# EAGLE design Sprite_Sail (EAGLE 9.0.0)
Assembly variants: hdmid
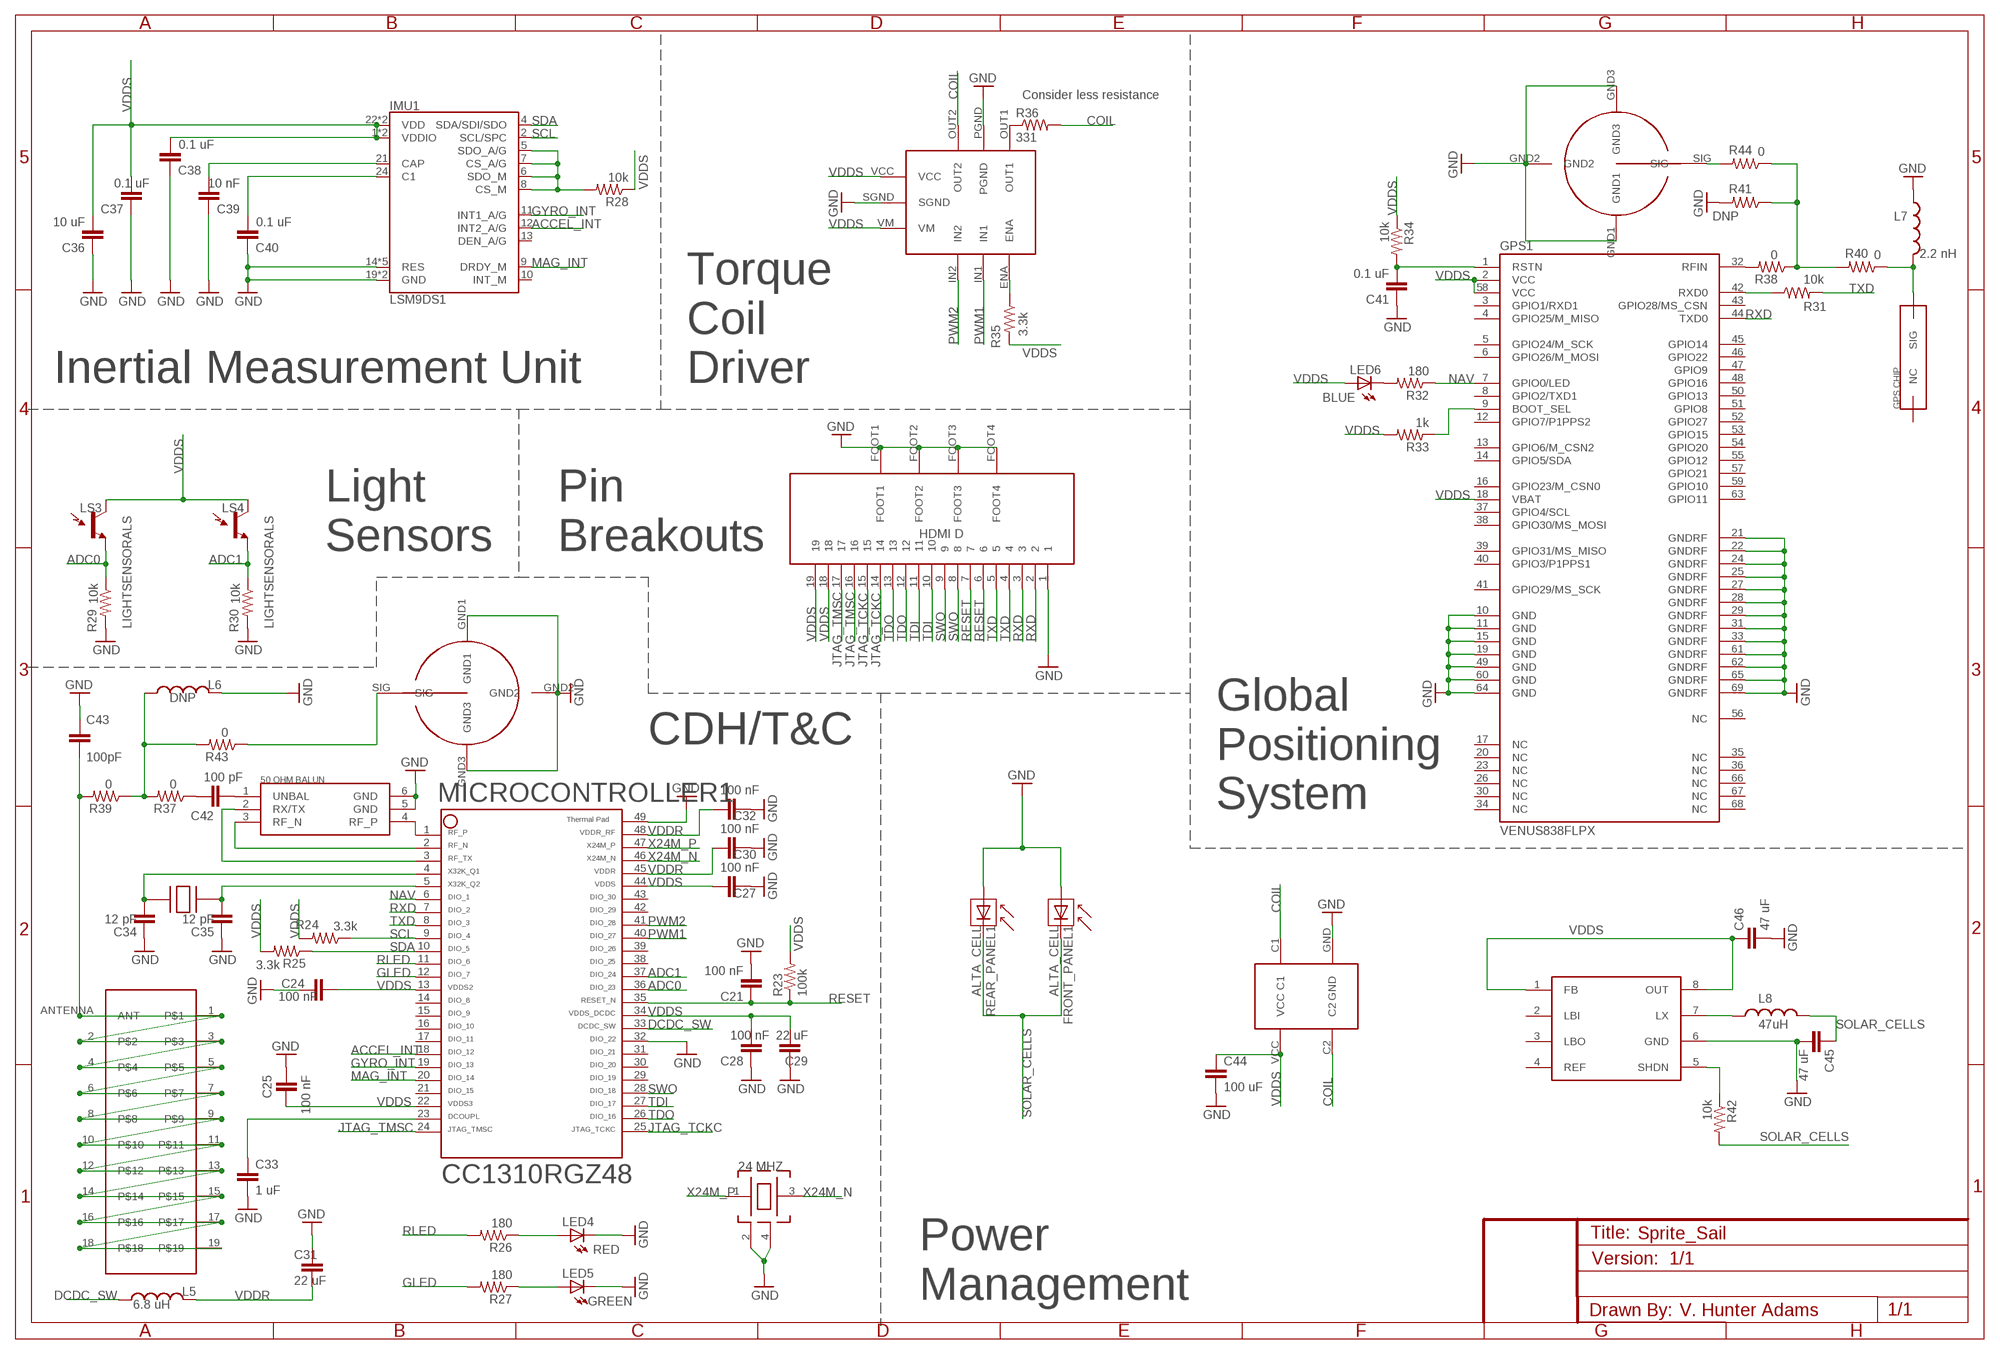
[diagram p0: schematic, sheet 1]

## Parts
32.1  FC-135  [FC-135]
BALUN1  JOHANSON_BALUN  [JOHANSON_BALUN]
C21  100 nF  CAP0402-CAP  [0402-CAP]
C24  100 nF  CAP0402-CAP  [0402-CAP]
C25  100 nF  CAP0402-CAP  [0402-CAP]
C27  100 nF  CAP0402-CAP  [0402-CAP]
C28  100 nF  CAP0402-CAP  [0402-CAP]
C29  22 uF  CAP0402-CAP  [0402-CAP]
C30  100 nF  CAP0402-CAP  [0402-CAP]
C31  22 uF  CAP0402-CAP  [0402-CAP]
C32  100 nF  CAP0402-CAP  [0402-CAP]
C33  1 uF  CAP0402-CAP  [0402-CAP]
C34  12 pF  CAP0402-CAP  [0402-CAP]
C35  12 pF  CAP0402-CAP  [0402-CAP]
C36  10 uF  CAP0402-CAP  [0402-CAP]
C37  0.1 uF  CAP0402-CAP  [0402-CAP]
C38  0.1 uF  CAP0402-CAP  [0402-CAP]
C39  10 nF  CAP0402-CAP  [0402-CAP]
C40  0.1 uF  CAP0402-CAP  [0402-CAP]
C41  0.1 uF  CAP0402-CAP  [0402-CAP]
C42  100 pF  CAP0402-CAP  [0402-CAP]
C43  100pF  CAP0603-CAP  [0603-CAP]
C44  100 uF  CAP0805  [0805]
C45  47 uF  CAP0805  [0805]
C46  47 uF  CAP0805  [0805]
FRONT_PANEL1  ALTA_CELL  [ALTA_CELL]
GPS1  VENUS838FLPX  [VENUS838FLPX]
IMU1  LSM9DS1  [LGA24-8X4]
L5  6.8 uH  INDUCTOR0603  [0603]
L6  DNP  INDUCTOR0603  [0603]
L7  2.2 nH  INDUCTOR0603  [0603]
L8  47uH  INDUCTOR0603  [0603]
LED4  RED  LED0603  [LED-0603]
LED5  GREEN  LED0603  [LED-0603]
LED6  BLUE  LED0603  [LED-0603]
LS3  LIGHTSENSORALS  [ALS-PT19]
LS4  LIGHTSENSORALS  [ALS-PT19]
MICROCONTROLLER1  CC1310  [CC1310]
R23  100k  RESISTOR0402-RES  [0402-RES]
R24  3.3k  RESISTOR0402-RES  [0402-RES]
R25  3.3k  RESISTOR0402-RES  [0402-RES]
R26  180  RESISTOR0402-RES  [0402-RES]
R27  180  RESISTOR0402-RES  [0402-RES]
R28  10k  RESISTOR0402-RES  [0402-RES]
R29  10k  RESISTOR0402-RES  [0402-RES]
R30  10k  RESISTOR0402-RES  [0402-RES]
R31  10k  RESISTOR0402-RES  [0402-RES]
R32  180  RESISTOR0402-RES  [0402-RES]
R33  1k  RESISTOR0402-RES  [0402-RES]
R34  10k  RESISTOR0402-RES  [0402-RES]
R35  3.3k  RESISTOR0402-RES  [0402-RES]
R36  331  RESISTOR0402-RES  [0402-RES]
R37  0  RESISTOR0603-RES  [0603-RES]
R38  0  RESISTOR0603-RES  [0603-RES]
R39  0  RESISTOR0603-RES  [0603-RES]
R40  0  RESISTOR0603-RES  [0603-RES]
R41  DNP  RESISTOR0603-RES  [0603-RES]
R42  10k  RESISTOR0402-RES  [0402-RES]
R43  0  RESISTOR0603-RES  [0603-RES]
R44  0  RESISTOR0603-RES  [0603-RES]
REAR_PANEL1  ALTA_CELL  [ALTA_CELL]
TSX1  TSX-3225  [TSX-3225]
U$1  LV8417CS  [LV8417CS]
U$10  JOHANSON_GPS_CHIP  [JOHANSON_GPS_CHIP]
U$11  PANASONIC_RECTIFIER  [PANASONIC_RECTIFIER]
U$12  PCB_ANTENNA  [PCB_ANTENNA]
U$13  MM5329-2700  [MM5829-2700]
U$14  MM5329-2700  [MM5829-2700]
U$15  L6920  [L6920]
U$16  HDMID  [HDMID]

## Nets
ACCEL_INT: IMU1.12(INT2_A/G) MICROCONTROLLER1.18
ADC0: LS3.E(E1) MICROCONTROLLER1.36 R29.1
ADC1: LS4.E(E1) MICROCONTROLLER1.37 R30.1
ANTENNA1: C43.2 R39.2 U$12.1 U$12.2 U$12.3 U$12.4 U$12.5 U$12.6 U$12.7 U$12.8 U$12.9 U$12.10 U$12.11 U$12.12 U$12.13 U$12.14 U$12.15 U$12.16 U$12.17 U$12.18 U$12.19 U$12.ANTENNA(ANT)
COIL: R36.2 U$1.OUT2 U$11.C1 U$11.C2
DCDC_SW: L5.1 MICROCONTROLLER1.33
GLED: MICROCONTROLLER1.12 R27.2
GND: BALUN1.5(GND) BALUN1.6(GND) C21.2 C24.2 C25.2 C27.2 C28.2 C29.2 C30.2 C31.2 C32.2 C33.2 C34.2 C35.2 C36.2 C37.2 C38.2 C39.2 C40.2 C41.2 C43.1 C44.2 C45.2 C46.2 FRONT_PANEL1.- GPS1.10(GND) GPS1.11(GND) GPS1.15(GND) GPS1.19(GND) GPS1.21(GNDRF) GPS1.22(GNDRF) GPS1.24(GNDRF) GPS1.25(GNDRF) GPS1.27(GNDRF) GPS1.28(GNDRF) GPS1.29(GNDRF) GPS1.31(GNDRF) GPS1.33(GNDRF) GPS1.49(GND) GPS1.60(GND) GPS1.61(GNDRF) GPS1.62(GNDRF) GPS1.64(GND) GPS1.65(GNDRF) GPS1.69(GNDRF) IMU1.14(RES) IMU1.15(RES) IMU1.16(RES) IMU1.17(RES) IMU1.18(RES) IMU1.19(GND) IMU1.20(GND) L6.2 L7.1 LED4.C LED5.C MICROCONTROLLER1.32 MICROCONTROLLER1.49 R29.2 R30.2 R41.2 REAR_PANEL1.- TSX1.2 TSX1.4 U$1.PGND U$1.SGND U$11.GND U$13.GND1 U$13.GND2 U$13.GND3 U$14.GND1 U$14.GND2 U$14.GND3 U$15.6(GND) U$16.1 U$16.FOOT1 U$16.FOOT2 U$16.FOOT3 U$16.FOOT4
GYRO_INT: IMU1.11(INT1_A/G) MICROCONTROLLER1.19
JTAG_TCKC: MICROCONTROLLER1.25 U$16.14 U$16.15
JTAG_TMSC: MICROCONTROLLER1.24 U$16.16 U$16.17
MAG_INT: IMU1.9(DRDY_M) MICROCONTROLLER1.20
N$49: C33.1 MICROCONTROLLER1.23
N$50: 32.1.P2 C34.1 MICROCONTROLLER1.4
N$51: 32.1.P1 C35.1 MICROCONTROLLER1.5
N$52: LED4.A R26.1
N$53: LED5.A R27.1
N$54: C39.1 IMU1.21(CAP)
N$55: C40.1 IMU1.24(C1)
N$56: IMU1.5(SDO_A/G) IMU1.6(SDO_M) IMU1.7(CS_A/G) IMU1.8(CS_M) R28.2
N$57: GPS1.42(RXD0) R31.1
N$58: LED6.C R32.2
N$59: GPS1.9(BOOT_SEL) R33.1
N$60: C41.1 GPS1.1(RSTN) R34.2
N$61: R35.1 U$1.ENA
N$62: R36.1 U$1.OUT1
N$63: BALUN1.4(RF_P) MICROCONTROLLER1.1
N$64: BALUN1.3(RF_N) MICROCONTROLLER1.2
N$65: BALUN1.2(RX/TX) MICROCONTROLLER1.3
N$66: BALUN1.1(UNBAL) C42.2
N$67: L6.1 R37.2 R39.1 R43.2
N$68: C42.1 R37.1
N$69: GPS1.32(RFIN) R38.2
N$70: R38.1 R40.2 R41.1 R44.1
N$71: L7.2 R40.1 U$10.SIG
N$72: R42.1 U$15.5(SHDN)
N$73: L8.1 U$15.7(LX)
N$74: R44.2 U$14.SIG
N$75: R43.1 U$13.SIG
NAV: GPS1.7(GPIO0/LED) MICROCONTROLLER1.6 R32.1
PWM1: MICROCONTROLLER1.40 U$1.IN1
PWM2: MICROCONTROLLER1.41 U$1.IN2
RESET: C21.1 MICROCONTROLLER1.35 R23.1 U$16.6 U$16.7
RLED: MICROCONTROLLER1.11 R26.2
RXD: GPS1.44(TXD0) MICROCONTROLLER1.7 U$16.2 U$16.3
SCL: IMU1.2(SCL/SPC) MICROCONTROLLER1.9 R24.1
SDA: IMU1.4(SDA/SDI/SDO) MICROCONTROLLER1.10 R25.1
SOLAR_CELLS: C45.1 FRONT_PANEL1.+ L8.2 R42.2 REAR_PANEL1.+
SWO: MICROCONTROLLER1.28 U$16.8 U$16.9
TDI: MICROCONTROLLER1.27 U$16.10 U$16.11
TDO: MICROCONTROLLER1.26 U$16.12 U$16.13
TXD: MICROCONTROLLER1.8 R31.2 U$16.4 U$16.5
VDDR: C30.1 C31.1 C32.1 L5.2 MICROCONTROLLER1.45 MICROCONTROLLER1.48
VDDS: C24.1 C25.1 C27.1 C28.1 C29.1 C36.1 C37.1 C38.1 C44.1 C46.1 GPS1.2(VCC) GPS1.18(VBAT) GPS1.58(VCC) IMU1.1(VDDIO) IMU1.3(VDDIO) IMU1.22(VDD) IMU1.23(VDD) LED6.A LS3.C(C1) LS4.C(C1) MICROCONTROLLER1.13 MICROCONTROLLER1.22 MICROCONTROLLER1.34 MICROCONTROLLER1.44 R23.2 R24.2 R25.2 R28.1 R33.2 R34.1 R35.2 U$1.VCC U$1.VM U$11.VCC U$15.1(FB) U$15.8(OUT) U$16.18 U$16.19
X24M_N: MICROCONTROLLER1.46 TSX1.3
X24M_P: MICROCONTROLLER1.47 TSX1.1
Unconnected: GPS1.3(GPIO1/RXD1) GPS1.4(GPIO25/M_MISO) GPS1.5(GPIO24/M_SCK) GPS1.6(GPIO26/M_MOSI) GPS1.8(GPIO2/TXD1) GPS1.12(GPIO7/P1PPS2) GPS1.13(GPIO6/M_CSN2) GPS1.14(GPIO5/SDA) GPS1.16(GPIO23/M_CSN0) GPS1.17(NC) GPS1.20(NC) GPS1.23(NC) GPS1.26(NC) GPS1.30(NC) GPS1.34(NC) GPS1.35(NC) GPS1.36(NC) GPS1.37(GPIO4/SCL) GPS1.38(GPIO30/MS_MOSI) GPS1.39(GPIO31/MS_MISO) GPS1.40(GPIO3/P1PPS1) GPS1.41(GPIO29/MS_SCK) GPS1.43(GPIO28/MS_CSN) GPS1.45(GPIO14) GPS1.46(GPIO22) GPS1.47(GPIO9) GPS1.48(GPIO16) GPS1.50(GPIO13) GPS1.51(GPIO8) GPS1.52(GPIO27) GPS1.53(GPIO15) GPS1.54(GPIO20) GPS1.55(GPIO12) GPS1.56(NC) GPS1.57(GPIO21) GPS1.59(GPIO10) GPS1.63(GPIO11) GPS1.66(NC) GPS1.67(NC) GPS1.68(NC) IMU1.10(INT_M) IMU1.13(DEN_A/G) MICROCONTROLLER1.14 MICROCONTROLLER1.15 MICROCONTROLLER1.16 MICROCONTROLLER1.17 MICROCONTROLLER1.21 MICROCONTROLLER1.29 MICROCONTROLLER1.30 MICROCONTROLLER1.31 MICROCONTROLLER1.38 MICROCONTROLLER1.39 MICROCONTROLLER1.42 MICROCONTROLLER1.43 U$10.NC U$15.2(LBI) U$15.3(LBO) U$15.4(REF)

## Notes on the sheet
- Consider less resistance
- Inertial Measurement Unit
- Torque
  Coil
  Driver
- Light
  Sensors
- Pin
  Breakouts
- CDH/T&C
- Global
  Positioning
  System
- Power
  Management

## Library data of the parts
32.1 = FC-135:FC-135: FC-135 32.768KA-AG0
BALUN1 = JOHANSON_BALUN:JOHANSON_BALUN
C21 C24 C25 C27-C46 = SparkFun:CAP: Capacitor Standard 0603 ceramic capacitor, and 0.1" leaded capacitor.
FRONT_PANEL1 REAR_PANEL1 = ALTA_CELL:ALTA_CELL
GPS1 = VENUS838FLPX:VENUS838FLPX: Venus838FLPx-L
IMU1 = SparkFun-Sensors:LSM9DS1: LSM9DS1 3D accelerometer, gyroscope & magnetometer The LSM9DS1 is a system-in-package featuring a 3D digital linear acceleration sensor, a 3D digital angular rate sensor, and a 3D digital magnetic sensor. The LSM9DS1 has a linear acceleration full scale of ±2g/±4g/±8/±16 g, a magnetic field full scale of ±4/±8/±12/±16 gauss and an angular rate of ±245/±500/±2000 dps. The LSM9DS1 includes an I2 C serial bus interface supporting standard and fast mode (100 kHz and 400 kHz) and an SPI serial standard interface. Magnetic, accelerometer and gyroscope sensing can be enabled or set in power-down mode separately for smart power management. The LSM9DS1 is available in a plastic land grid array package (LGA) and it is guaranteed to operate over an extended temperature range from -40 °C to +85 °C.; PROD_ID: IC-12536
L5-L8 = SparkFun:INDUCTOR: Inductors Basic Inductor/Choke - 0603 and 1206. Footprints are not proven and vary greatly between part numbers.
LED4-LED6 = SparkFun:LED: LEDs Standard schematic elements and footprints for 5mm, 3mm, 1206, and 0603 sized LEDs. 5mm - Spark Fun Electronics SKU : COM-00529 (and others)
LS3 LS4 = SparkFun-Sensors:LIGHTSENSOR: Ambient Light Sensor Simple light detection sensor. Output varies with light intensity input. Spark Fun Electronics SKU : COM-08348; PROD_ID: IC-11836
MICROCONTROLLER1 = CC1310RGZ48:CC1310: CC1310 RGZ48 package
R23-R44 = SparkFun:RESISTOR: Resistor Basic schematic elements and footprints for 0603, 1206, and PTH resistors.
TSX1 = TSX-3225:TSX-3225
U$1 = LV8417CS:LV8417CS
U$10 = johanson_gps_chip:JOHANSON_GPS_CHIP
U$11 = Panasonic_Rectifier:PANASONIC_RECTIFIER
U$12 = PCB_ANTENNA:PCB_ANTENNA
U$13 U$14 = MM5329-2700:MM5329-2700
U$15 = L6920:L6920
U$16 = HDMID:HDMID

## Board
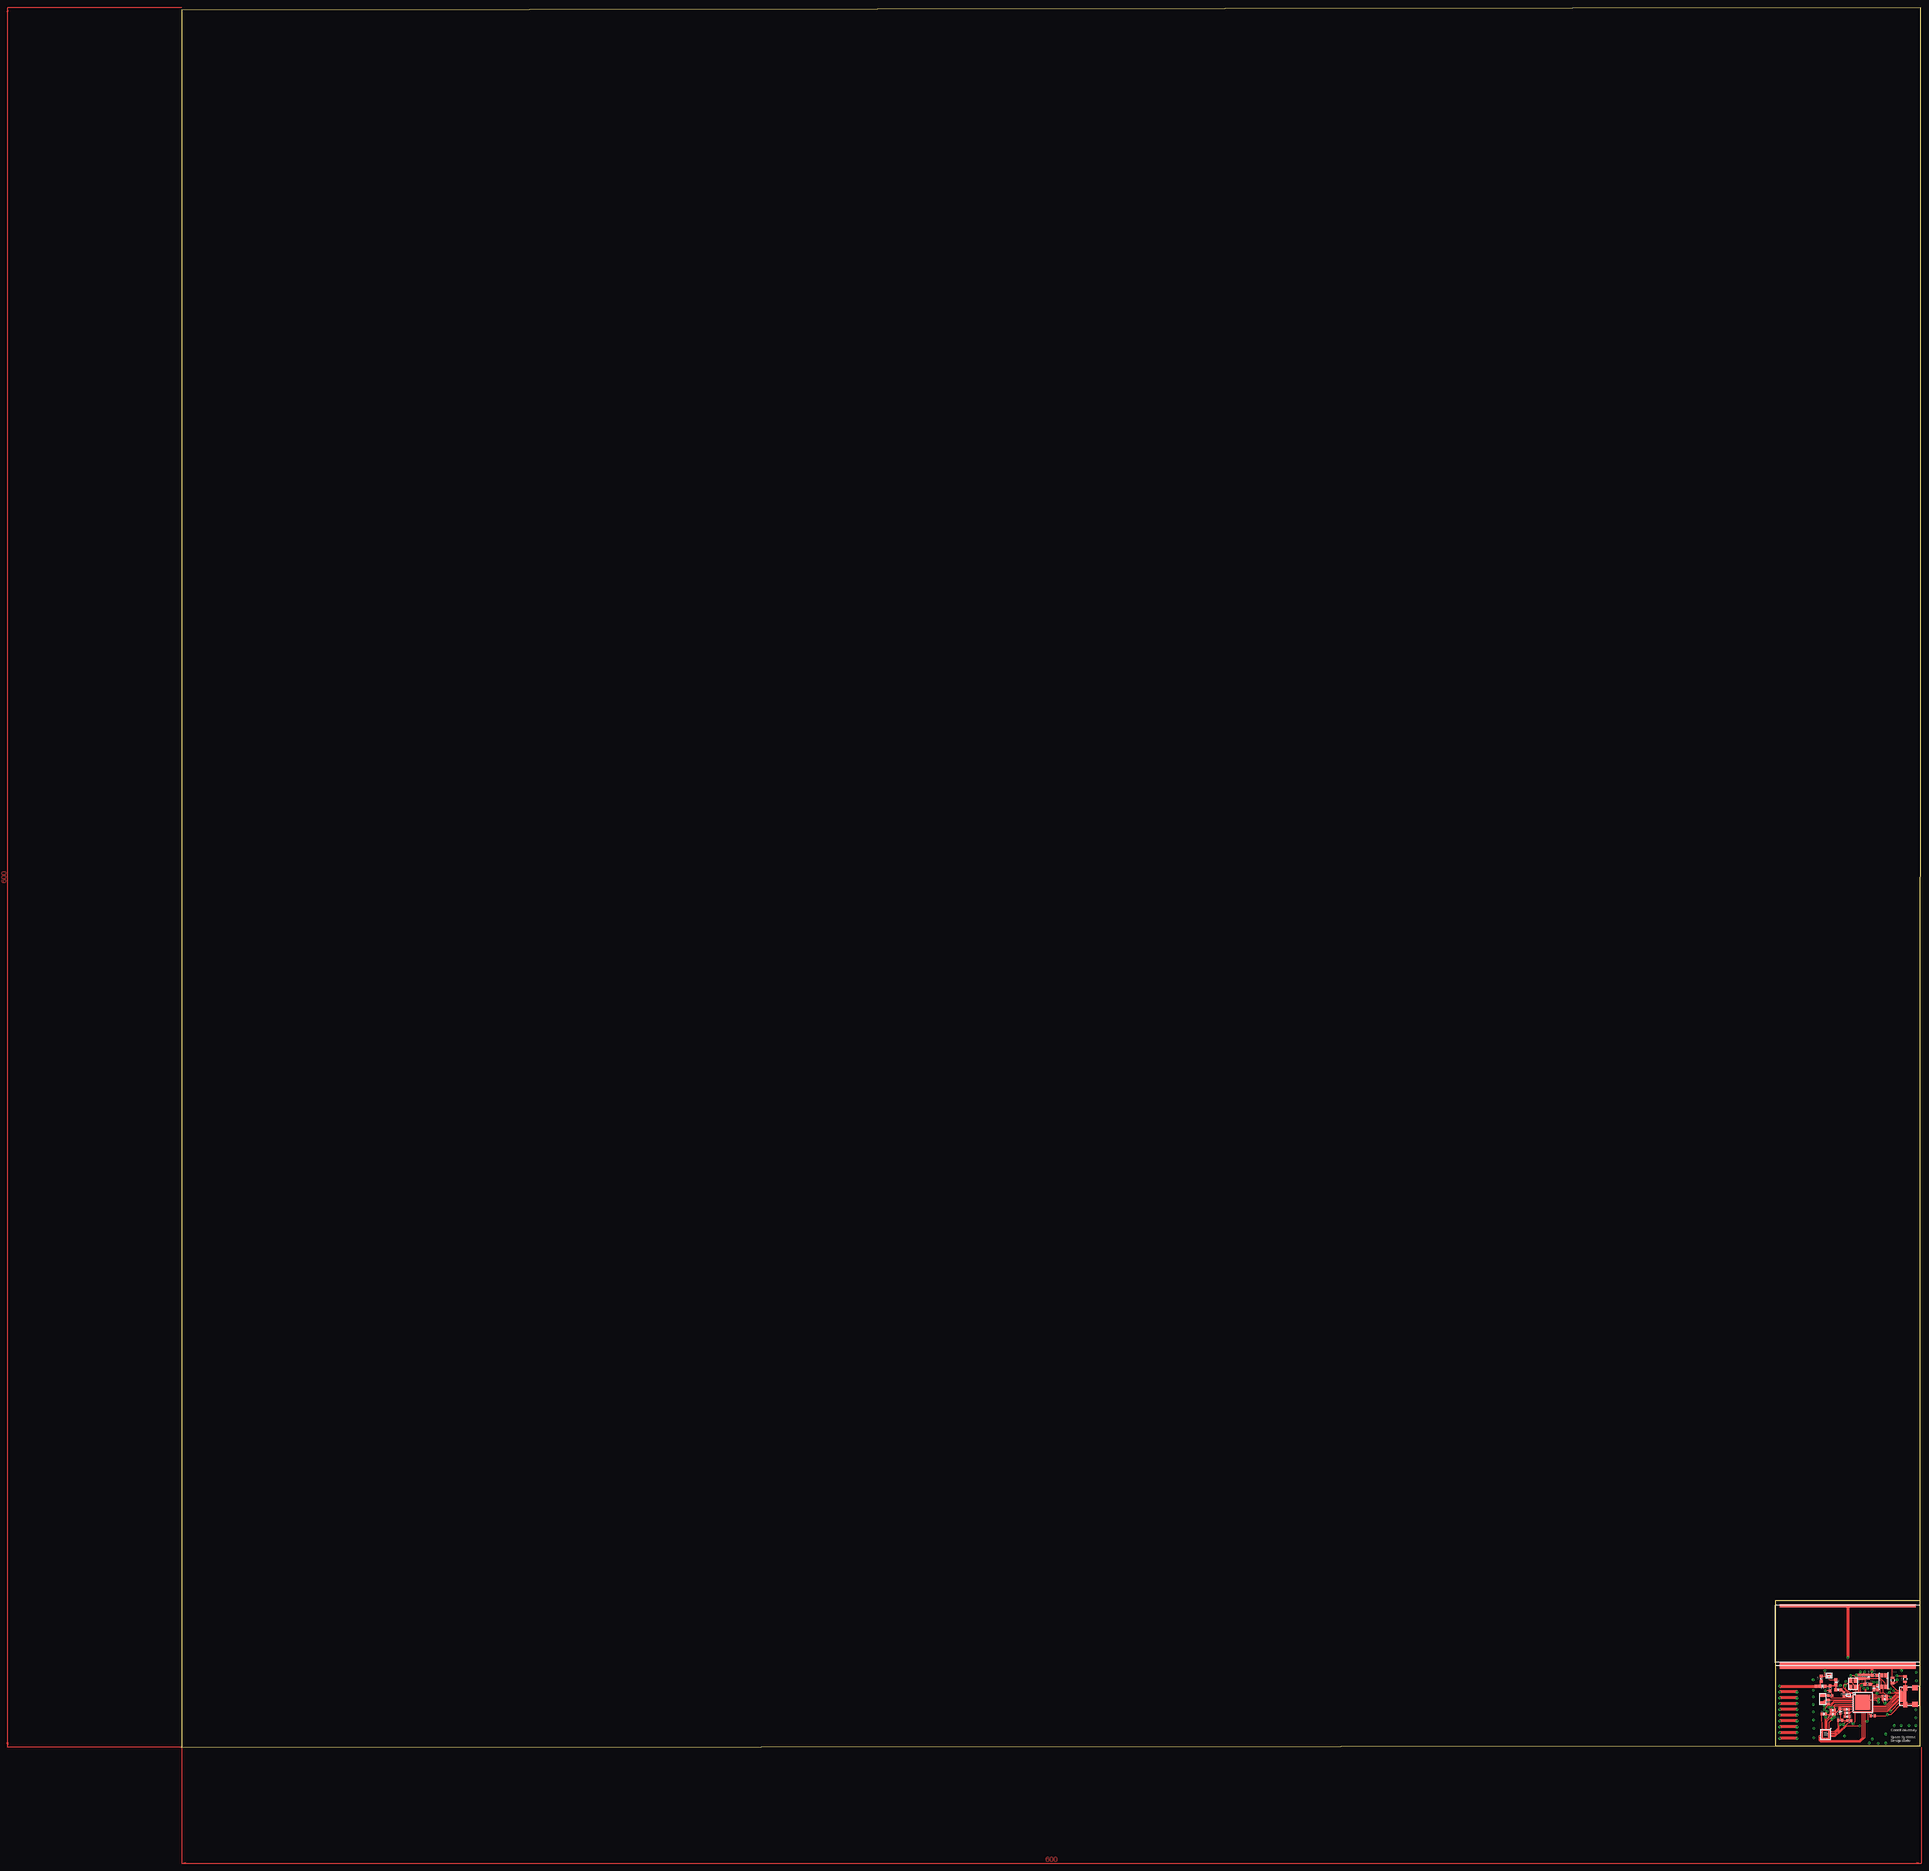
[diagram p1: board, top side]
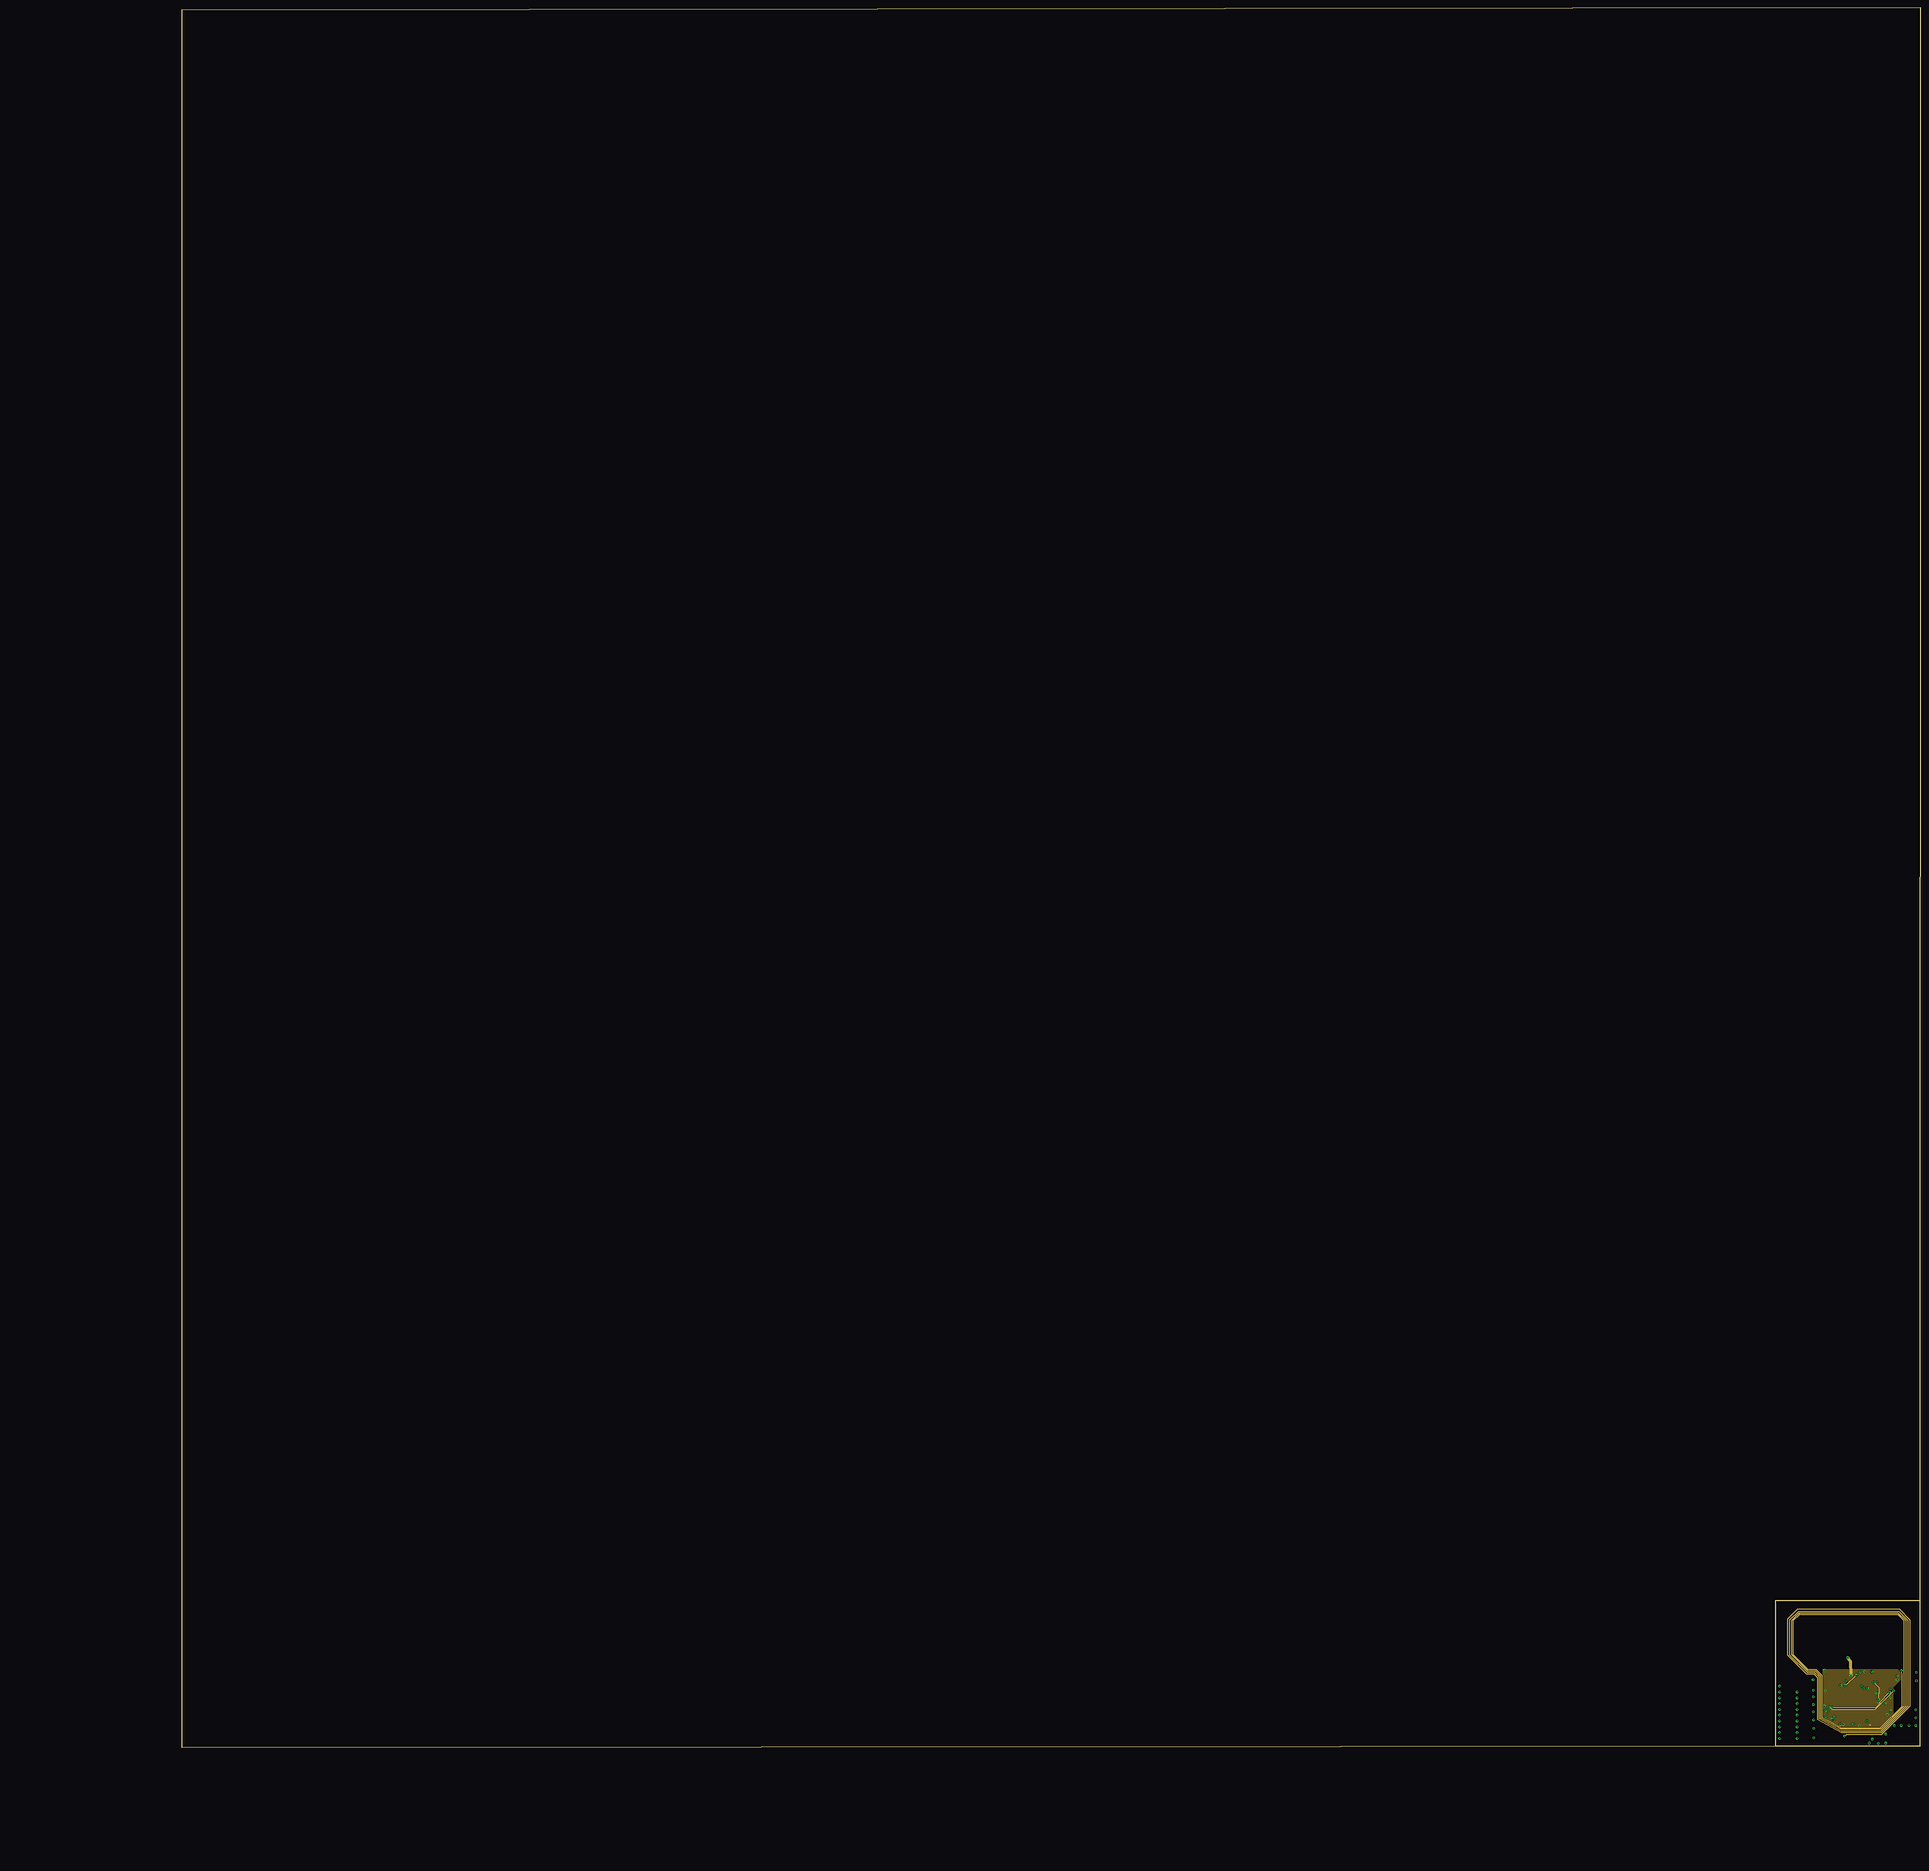
[diagram p2: board, inner layer Route2]
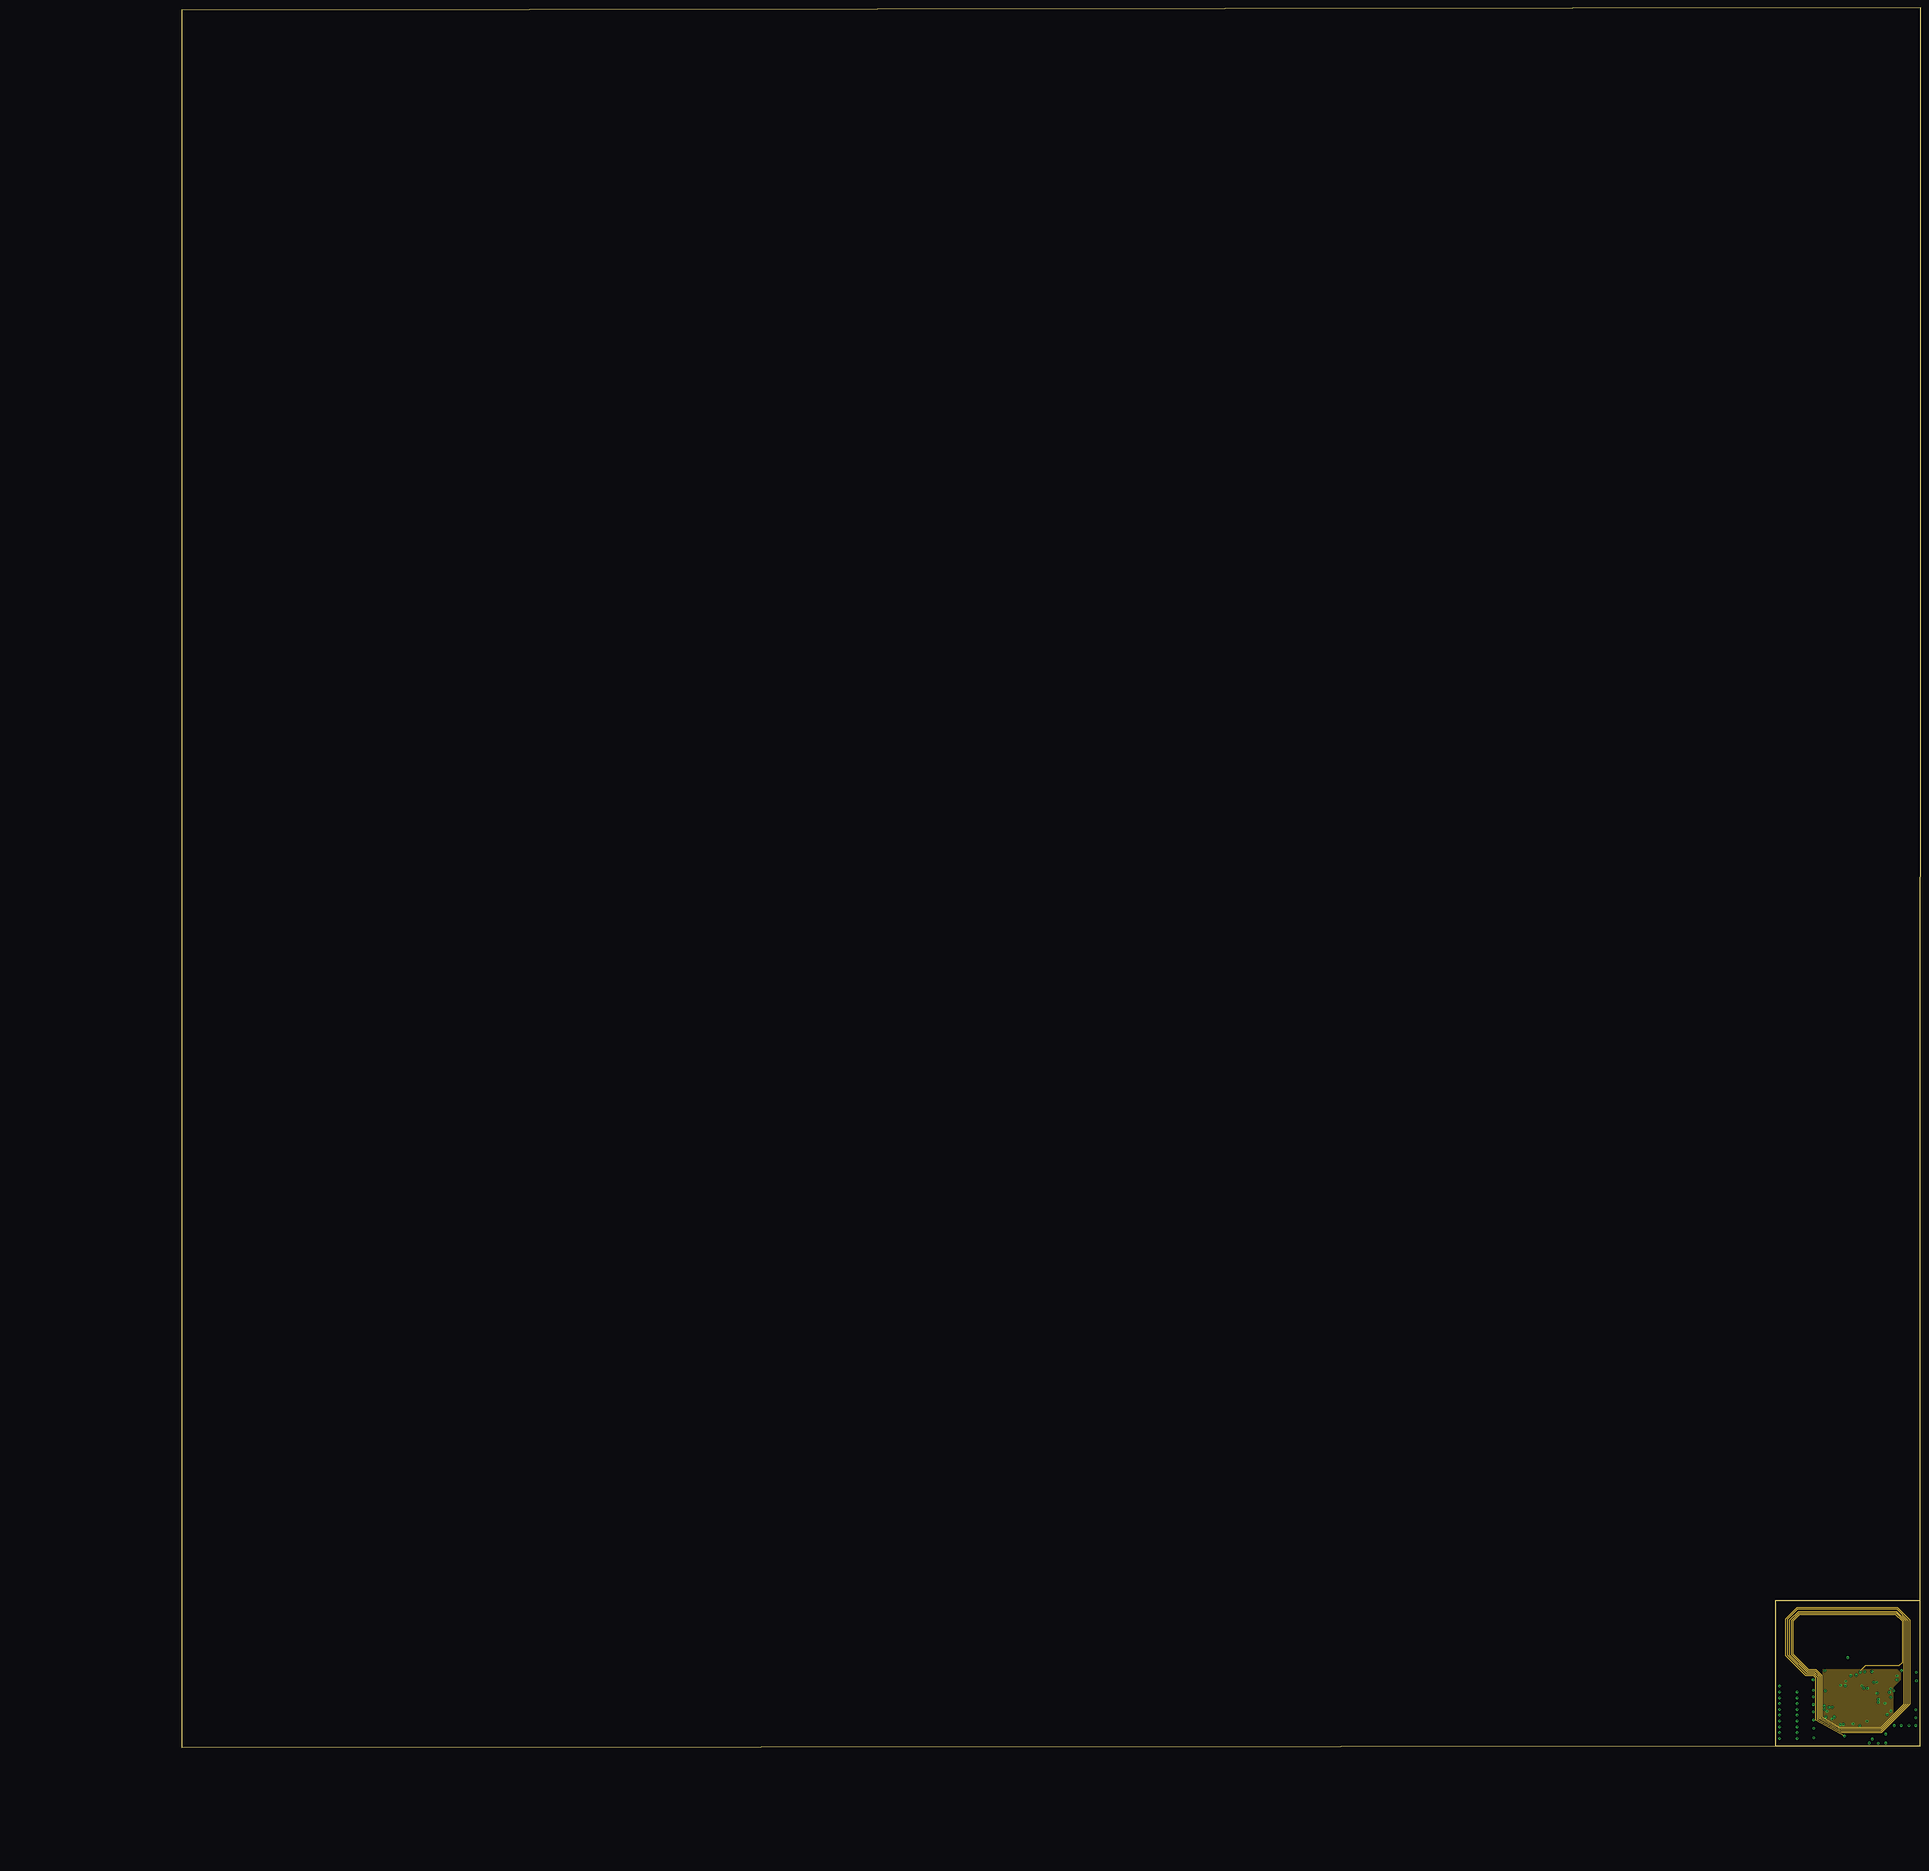
[diagram p3: board, inner layer Route15]
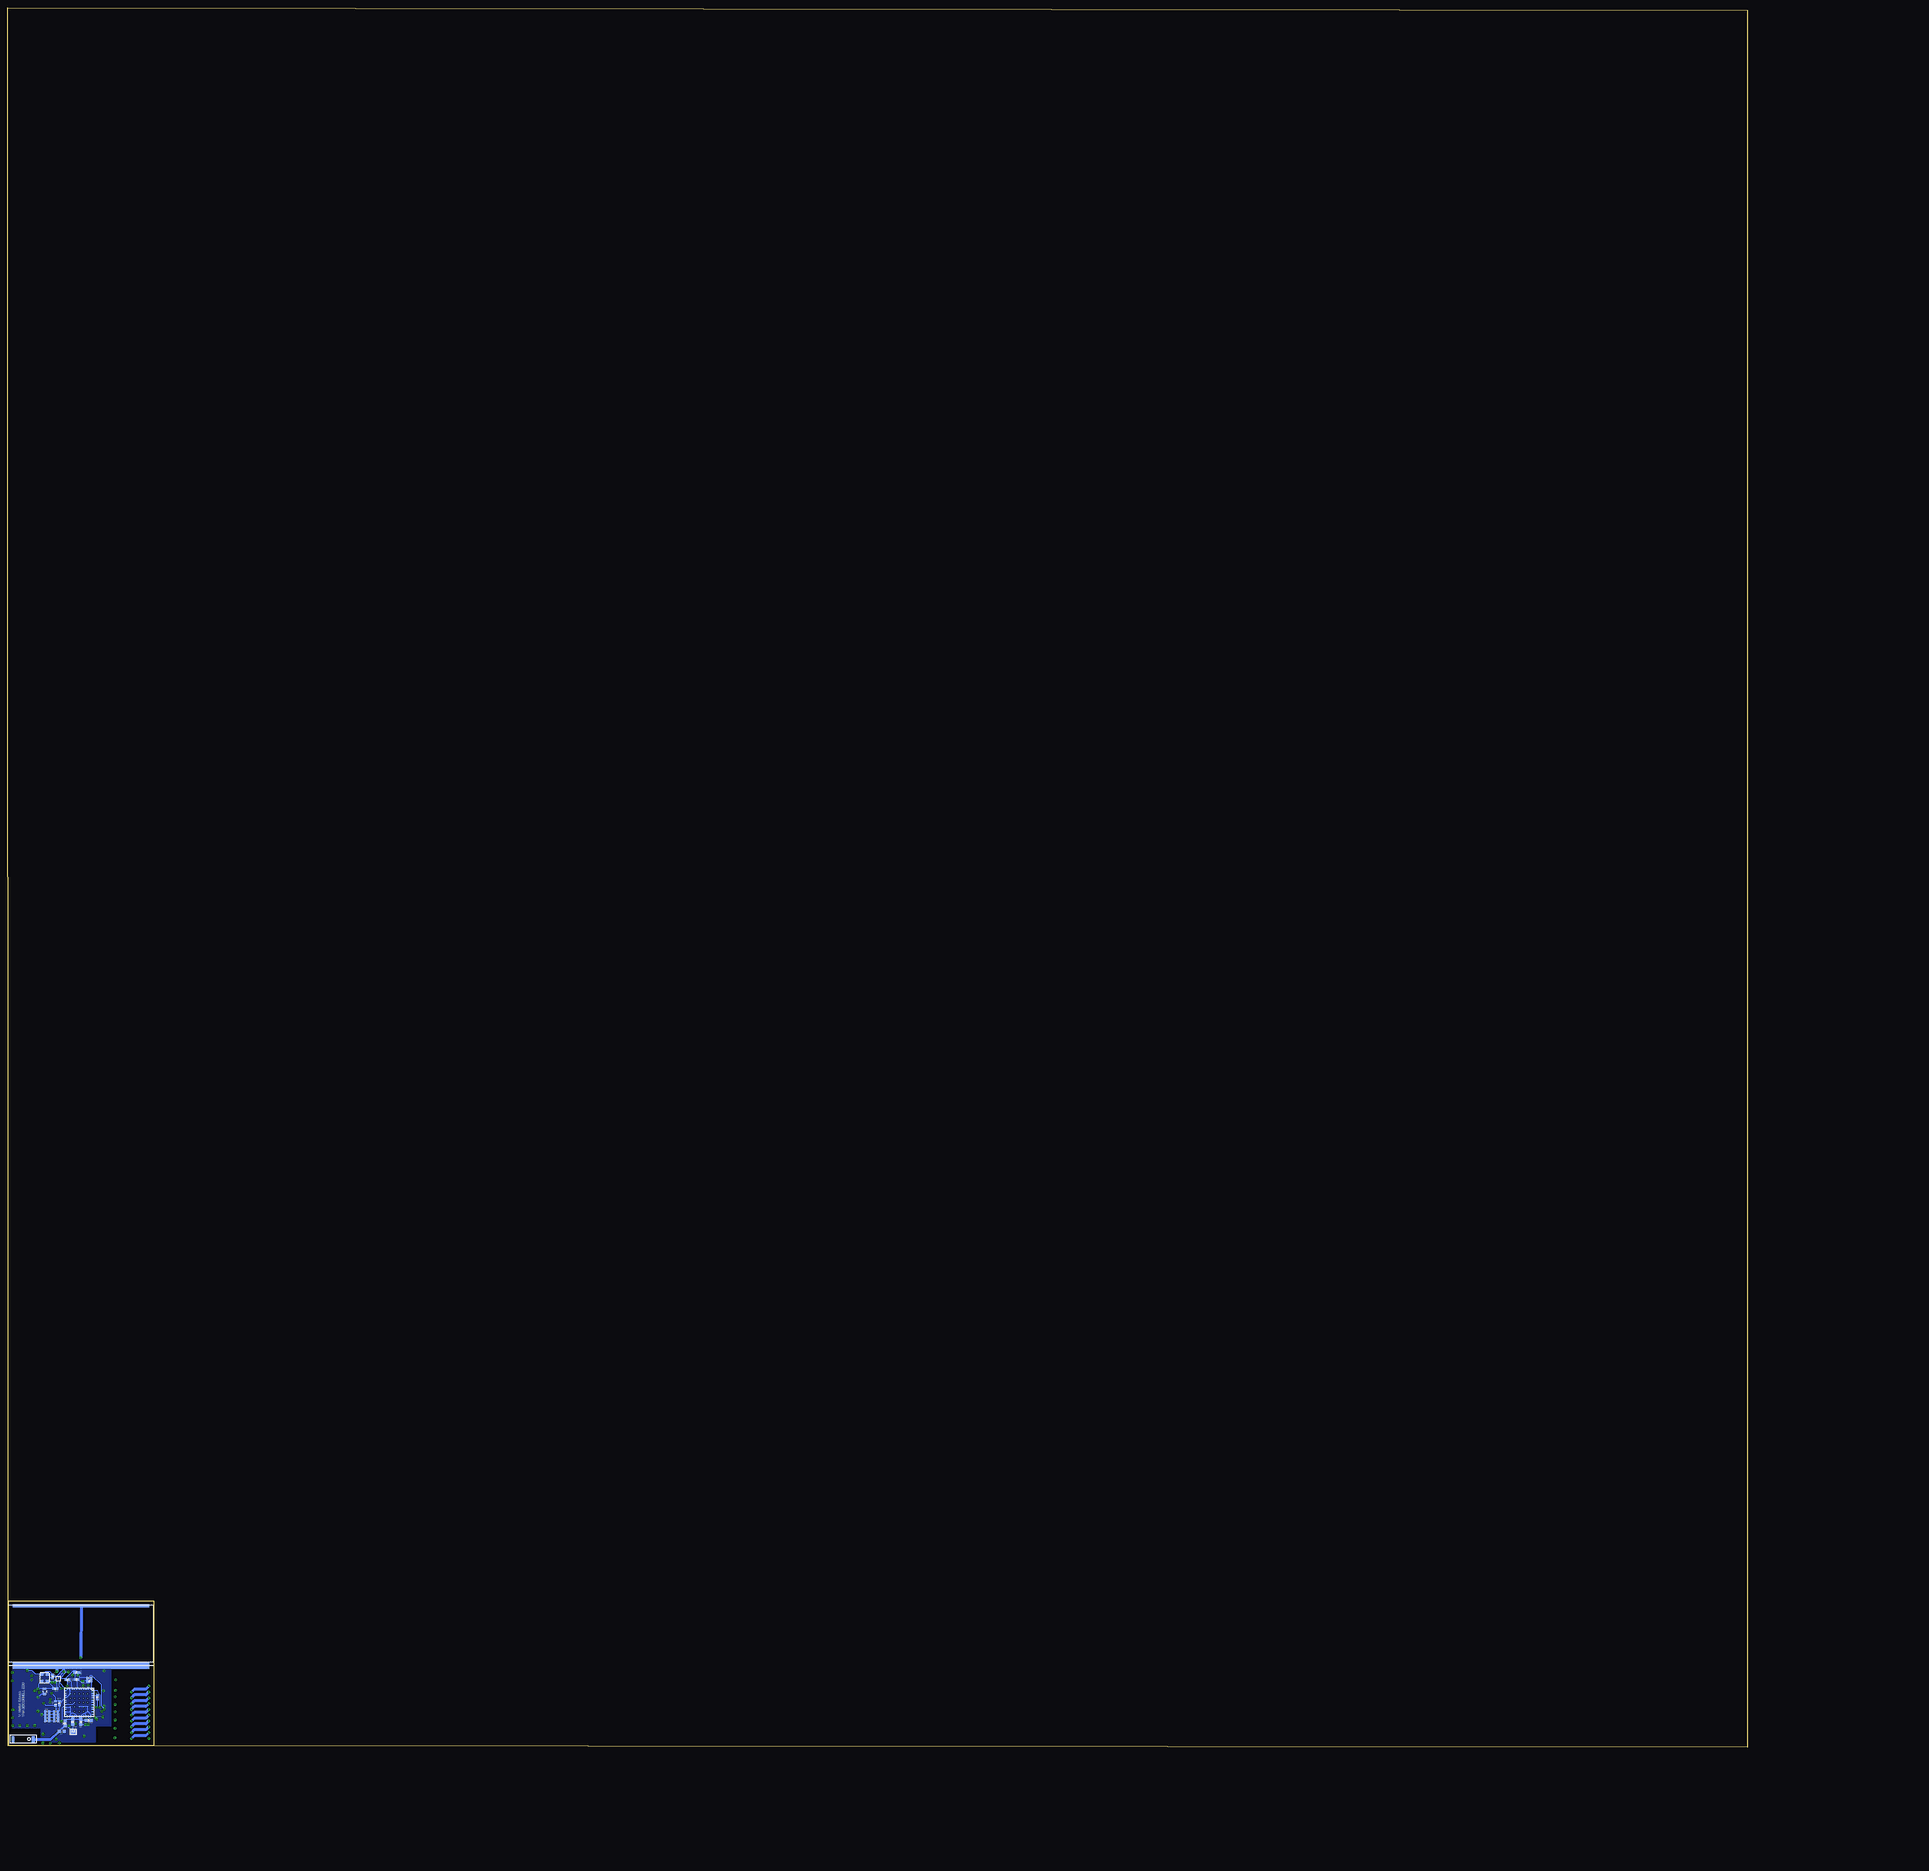
[diagram p4: board, bottom side, seen from below]

Size 599.97 x 599.87 mm. Coordinates in mm from the lower left corner, seen from the top.
Outline: 0,0 599.71,0.51 599.97,599.87 0,599.11 0,0
Outline: 549.66,0.51 599.66,0.51 599.66,50.51 549.66,50.51 549.66,0.51
Copper layers (1*16): Top 0.035mm / dielectric 1.5mm / Bottom 0.035mm
Design rules "default": minimum track width 6mil, minimum drill 0.35mm, track to track 6mil, track to pad 6mil, pad to pad 6mil, via to via 6mil, smd to smd 6mil, copper to edge 40mil, drill to drill 6mil, minimum pad ring 10mil, minimum via ring 8mil, stop-mask expansion 4mil, vias tented up to drill 0mil, thermal gap 10mil

### Footprints (pad centres in the part's own frame; a part is rotated, then mirrored left to right if it is on the bottom)
FC-135 = smd 1 x 1.8: P1 -1.25,0; P2 1.25,0
JOHANSON_BALUN = smd 0.45 x 0.25: 1 -0.4,0.5; 2 -0.4,0; 3 -0.4,-0.5; 4 0.4,-0.5; 5 0.4,0; 6 0.4,0.5
0402-CAP = smd 0.7 x 0.9: 1 -0.65,0; 2 0.65,0
0603-CAP = smd 1.1 x 1: 1 -0.85,0; 2 0.85,0
0805 = smd 0.8 x 1.2: 1 -0.9,0; 2 0.9,0
ALTA_CELL = smd 47 x 2.2: + 0,10.9 | smd 47 x 1.1: - 0,-9.65
VENUS838FLPX = smd 0.7 x 0.36: 1 -4.69,4; 2 -4.69,3.2; 3 -4.69,2.4; 4 -4.69,1.6; 5 -4.69,0.8; 6 -4.69,0; 7 -4.69,-0.8; 8 -4.69,-1.6; 9 -4.69,-2.4; 10 -4.69,-3.2; 11 -4.69,-4; 23 4.69,-4; 24 4.69,-3.2; 25 4.69,-2.4; 26 4.69,-1.6; 27 4.69,-0.8; 28 4.69,0; 29 4.69,0.8; 30 4.69,1.6; 31 4.69,2.4; 32 4.69,3.2; 33 4.69,4 | smd 0.36 x 0.7: 12 -4,-4.69; 13 -3.2,-4.69; 14 -2.4,-4.69; 15 -1.6,-4.69; 16 -0.8,-4.69; 17 0,-4.69; 18 0.8,-4.69; 19 1.6,-4.69; 20 2.4,-4.69; 21 3.2,-4.69; 22 4,-4.69; 34 4,4.69; 35 3.2,4.69; 36 2.4,4.69; 37 1.6,4.69; 38 0.8,4.69; 39 0,4.69; 40 -0.8,4.69; 41 -1.6,4.69; 42 -2.4,4.69; 43 -3.2,4.69; 44 -4,4.69 | smd 0.6 x 0.6: 45 -3,3; 46 -3,1.5; 47 -3,0; 48 -3,-1.5; 49 -3,-3; 50 -1.5,3; 51 -1.5,1.5; 52 -1.5,0; 53 -1.5,-1.5; 54 -1.5,-3; 55 0,3; 56 0,1.5; 57 0,0; 58 0,-1.5; 59 0,-3; 60 1.5,3; 61 1.5,1.5; 62 1.5,0; 63 1.5,-1.5; 64 1.5,-3; 65 3,3; 66 3,1.5; 67 3,0; 68 3,-1.5; 69 3,-3
LGA24-8X4 = smd 0.27 x 0.45: 1 -1.505,1.225; 6 -1.505,-1.225; 7 -1.075,-1.225; 8 -0.645,-1.225; 9 -0.215,-1.225; 10 0.215,-1.225; 11 0.645,-1.225; 12 1.075,-1.225; 13 1.505,-1.225; 18 1.505,1.225; 19 1.075,1.225; 20 0.645,1.225; 21 0.215,1.225; 22 -0.215,1.225; 23 -0.645,1.225; 24 -1.075,1.225 | smd 0.45 x 0.27: 2 -1.475,0.645; 3 -1.475,0.215; 4 -1.475,-0.215; 5 -1.475,-0.645; 14 1.475,-0.645; 15 1.475,-0.215; 16 1.475,0.215; 17 1.475,0.645
0603 = smd 1.1 x 1: 1 -0.85,0; 2 0.85,0
LED-0603 = smd 0.8 x 0.8: A 0,-0.75; C 0,0.75
ALS-PT19 = smd 0.8 x 0.8: C -0.75,0; E 0.75,0
CC1310 = smd 0.7 x 0.3: 1 -3.35,2.75; 2 -3.35,2.25; 3 -3.35,1.75; 4 -3.35,1.25; 5 -3.35,0.75; 6 -3.35,0.25; 7 -3.35,-0.25; 8 -3.35,-0.75; 9 -3.35,-1.25; 10 -3.35,-1.75; 11 -3.35,-2.25; 12 -3.35,-2.75; 25 3.35,-2.75; 26 3.35,-2.25; 27 3.35,-1.75; 28 3.35,-1.25; 29 3.35,-0.75; 30 3.35,-0.25; 31 3.35,0.25; 32 3.35,0.75; 33 3.35,1.25; 34 3.35,1.75; 35 3.35,2.25; 36 3.35,2.75 | smd 0.3 x 0.7: 13 -2.75,-3.35; 14 -2.25,-3.35; 15 -1.75,-3.35; 16 -1.25,-3.35; 17 -0.75,-3.35; 18 -0.25,-3.35; 19 0.25,-3.35; 20 0.75,-3.35; 21 1.25,-3.35; 22 1.75,-3.35; 23 2.25,-3.35; 24 2.75,-3.35; 37 2.75,3.35; 38 2.25,3.35; 39 1.75,3.35; 40 1.25,3.35; 41 0.75,3.35; 42 0.25,3.35; 43 -0.25,3.35; 44 -0.75,3.35; 45 -1.25,3.35; 46 -1.75,3.35; 47 -2.25,3.35; 48 -2.75,3.35 | smd 5.15 x 5.15: 49 0,0
0402-RES = smd 0.7 x 0.9: 1 -0.65,0; 2 0.65,0
0603-RES = smd 1.1 x 1: 1 -0.85,0; 2 0.85,0
TSX-3225 = smd 1.4 x 1.15: 1 -1.1,0.8; 2 1.1,0.8; 3 1.1,-0.8; 4 -1.1,-0.8
LV8417CS = smd 0.27 x 0.27: ENA -0.5,-0.5; IN1 0,-0.5; IN2 0.5,-0.5; OUT1 -0.5,0.5; OUT2 0.5,0.5; PGND 0,0.5; SGND 0,0; VCC -0.5,0; VM 0.5,0
JOHANSON_GPS_CHIP = smd 1 x 2: NC -3.5,0; SIG 3.5,0
PANASONIC_RECTIFIER = smd 1 x 1: C1 -0.95,1.2; C2 0.95,-1.2; GND 0.95,1.2; VCC -0.95,-1.2
PCB_ANTENNA = drill 0.35 pad 0.756: 1 -8.89,3.11; 2 -6.89,-2.89; 3 -6.89,3.11; 4 -4.89,-2.89; 5 -4.89,3.11; 6 -2.89,-2.89; 7 -2.89,3.11; 8 -0.89,-2.89; 9 -0.89,3.11; 10 1.11,-2.89; 11 1.11,3.11; 12 3.11,-2.89; 13 3.11,3.11; 14 5.11,-2.89; 15 5.11,3.11; 16 7.11,-2.89; 17 7.11,3.11; 18 9.11,-2.89; 19 9.11,3.11 | smd 1 x 1 bottom: ANTENNA -8.89,-9.39
MM5829-2700 = smd 0.4 x 1.7: GND1 -0.7,0; GND3 0.7,0 | smd 0.4 x 0.4: GND2 0,0.65 | smd 0.4 x 0.85: SIG 0,-0.425
L6920 = smd 0.45 x 1.35: 1 -0.975,-1.975; 2 -0.325,-1.975; 3 0.325,-1.975; 4 0.975,-1.975; 5 0.975,1.975; 6 0.325,1.975; 7 -0.325,1.975; 8 -0.975,1.975
HDMID = smd 0.23 x 0.85: 1 1.8,6.475; 3 1.4,6.475; 5 1,6.475; 7 0.6,6.475; 9 0.2,6.475; 11 -0.2,6.475; 13 -0.6,6.475; 15 -1,6.475; 17 -1.4,6.475; 19 -1.8,6.475 | smd 0.23 x 1: 2 1.6,5.25; 4 1.2,5.25; 6 0.8,5.25; 8 0.4,5.25; 10 0,5.25; 12 -0.4,5.25; 14 -0.8,5.25; 16 -1.2,5.25; 18 -1.6,5.25 | smd 1.8 x 1.38: FOOT1 -2.85,5.06; FOOT2 2.85,5.06 | smd 1.7 x 2: FOOT3 -2.85,1.7; FOOT4 2.85,1.7

### Placement (x,y rotation side)
32.1  566.07,16.56 90 top
BALUN1  575.03,17.99 90 top
C21  587.45,17.65 0 top
C24  586.33,12.23 180 bottom
C25  586.34,11.15 180 bottom
C27  586.35,10.07 180 bottom
C28  586.35,9 180 bottom
C29  583.3,12.24 0 bottom
C30  580.79,24.32 90 top
C31  579.7,24.3 90 top
C32  578.63,24.31 270 top
C33  583.34,10.79 0 top
C34  568.71,17.83 0 top
C35  567.97,15.61 270 top
C36  583.29,11.15 0 bottom
C37  583.28,10.08 0 bottom
C38  583.27,9 0 bottom
C39  575.22,9.22 180 top
C40  572.08,9.25 0 top
C41  571.85,23.86 180 bottom
C42  573.45,18.25 270 top
C43  565.51,23.53 270 top
C44  587.34,19.2 270 bottom
C45  590.07,23.02 270 top
C46  594.48,23.45 270 top
FRONT_PANEL1  574.69,39.08 180 bottom
GPS1  575.38,15.4 270 bottom
IMU1  567.06,4.34 270 top
L5  581.51,21.7 180 top
L6  568.59,20.24 270 top
L7  581.32,5.5 180 bottom
L8  583.96,24.79 180 top
LED4  572.14,12.37 180 top
LED5  574.4,10.5 270 top
LED6  576.15,25.73 90 bottom
LS3  583.48,15.05 90 bottom
LS4  584.97,20.46 270 top
MICROCONTROLLER1  579.92,15.52 0 top
R23  587.47,16.55 180 top
R24  569.56,12.72 180 top
R25  569.55,11.42 180 top
R26  574.41,12.99 0 top
R27  574.44,11.78 0 top
R28  566.48,11.41 180 top
R29  582.13,15.17 270 bottom
R30  583.76,20.34 90 top
R31  569.06,17.16 270 bottom
R32  576.26,23.31 180 bottom
R33  579.36,23.3 180 bottom
R34  571.85,22.73 0 bottom
R35  583.59,20.15 180 bottom
R36  584.48,24.34 90 bottom
R37  571.41,19.78 180 top
R38  572.05,9.23 0 bottom
R39  565.98,21.01 180 top
R40  580.2,8.18 90 bottom
R41  574.74,8.71 270 bottom
R42  581.93,24.31 90 top
R43  570.64,22.35 270 top
R44  577.61,8.7 270 bottom
REAR_PANEL1  574.71,39.07 180 top
TSX1  576.51,21.84 90 top
U$1  582.43,23.62 0 bottom
U$10  594.64,2.75 0 bottom
U$11  587.32,23.97 0 bottom
U$12  554.37,12.11 270 bottom
U$13  568.22,24.67 0 top
U$14  577.38,5.32 180 bottom
U$15  587.11,22.82 180 top
U$16  599.62,17.56 90 top

### Tracks (layer width: path | path; a pad name or v marks a point on that pad's centre or on a via)
ACCEL_INT
  Top 0.152: MICROCONTROLLER1.18 579.67,3.26 578.81,2.41 565.57,2.41 565.38,2.6 565.38,3.06 565.51,3.2 565.76,3.2 IMU1.12
ADC0  (via drill 0.35)
  Top 0.152: MICROCONTROLLER1.36 584.51,18.27 v584.83,18.59
  Bottom 0.152: 584.57,18.33 v584.83,18.59 583.48,17.24 LS3.E 582.15,15.8 arc-90 R29.1
ADC1
  Top 0.152: MICROCONTROLLER1.37 582.94,18.87 R30.1 583.78,19.71 LS4.E
ANTENNA1
  Top 0.152: 565.16,21.05 565.25,21.07
  Top 0.254: R39.2 565.16,21.05
  Top 0.508: 565.25,21.07 565.25,22.35 C43.2
  Top 1.016: U$12.2 U$12.3 | U$12.4 U$12.5 | U$12.6 U$12.7 | U$12.8 U$12.9 | U$12.10 U$12.11 | U$12.12 U$12.13 | U$12.14 U$12.15 | U$12.16 U$12.17 | U$12.18 U$12.19 | U$12.1 U$12.ANTENNA 563.77,21.01 R39.2 565.11,21
  Bottom 1.016: U$12.1 552.29,20.01 556.26,20.01 U$12.2 | U$12.3 552.27,17.99 556.27,17.99 U$12.4 | U$12.5 552.29,15.97 556.32,15.97 557.26,15.03 U$12.6 | U$12.7 552.25,14.01 556.26,14.01 557.26,13.01 U$12.8 | U$12.9 552.28,11.98 556.3,11.98 557.26,11.02 U$12.10 | U$12.11 552.27,9.99 556.27,9.99 U$12.12 | U$12.12 | U$12.13 552.26,8 556.27,8 557.26,7.01 U$12.14 | U$12.15 552.27,5.99 556.29,5.99 557.26,5.02 U$12.16 | U$12.17 552.3,3.96 556.32,3.96 557.26,3.03 U$12.18
COIL  (via drill 0.35)
  Route2 0.152: v593.24,26.38 593.25,24.68 593.25,13.95 585.9,6.6 572.23,6.61 572.18,6.61 565.89,10.16 565.9,10.82 | 565.9,10.82 565.89,10.83 | 565.9,10.82 565.9,24.57 563.77,26.7 561.17,26.7 555.97,31.9 555.97,43.68 558.14,45.85 | 558.14,45.85 558.22,45.92 | 558.14,45.85 591.92,45.85 594.03,43.73 594.03,14.1 586.02,6.09 572.28,6.09 565.35,9.91 565.38,24.38 563.6,26.15 561.07,26.15 555.4,31.82 555.4,43.81 557.97,46.38 592.02,46.38 594.63,43.77 594.63,14.05 586.09,5.51 572.44,5.5 564.85,9.7 564.85,24.2 563.41,25.64 560.87,25.64 554.77,31.75 554.77,43.95 557.75,46.93 592.25,46.93 595.36,43.82 595.36,14.11 586.19,4.93 572.47,4.97 564.3,9.5 564.28,23.98 563.17,25.09 560.59,25.09 554.08,31.6 554.08,44.18 557.54,47.63 592.54,47.63 596.08,43.96 596.08,14.16 586.25,4.33 574.14,4.33 v573.62,3.81
  Route15 0.152: v579,25.91 579,26.37 580.69,28.05 592.37,28.05 593.43,29.11 593.43,43.51 591.09,45.85 558.19,45.85 555.97,43.63 555.97,32.01 561.28,26.7 563.78,26.7 565.9,24.58 565.9,10.23 572.19,6.61 585.9,6.6 594.04,14.74 594.04,43.71 591.37,46.38 557.98,46.38 555.39,43.8 555.39,31.84 561.07,26.16 563.6,26.16 565.35,24.41 565.36,9.91 572.29,6.09 586.02,6.08 594.63,14.7 594.63,43.75 591.46,46.93 557.76,46.93 554.77,43.94 554.77,31.75 560.88,25.65 563.4,25.65 564.85,24.2 564.85,9.71 572.44,5.49 586.02,5.51 595.36,14.85 595.36,43.82 591.55,47.63 557.54,47.63 554.08,44.18 554.08,31.6 560.59,25.1 563.18,25.09 564.28,23.98 564.3,9.5 572.5,4.94 586.2,4.94 596.08,14.82 596.08,43.98 591.78,48.28 557.35,48.28 553.37,44.3 553.37,31.49 560.28,24.58 563.02,24.58 563.74,23.87 563.74,9.32 v573.62,3.81
  Bottom 0.152: 579.96,25.91 579.96,25.74 581.58,24.12 U$1.OUT2 | 579.96,25.91 579.96,26.24 580.32,26.59 580.96,26.59 583.08,24.48 584.82,24.48 585.16,24.14 585.16,24.08 U$11.C2 | 579.96,25.91 v579,25.91 | 593.12,26.36 v593.24,26.38 593.23,26.37 591.59,26.37 590.29,25.07 U$11.C1 587.69,25.17 586.96,25.9 585.38,25.9 R36.2
DCDC_SW  (via drill 0.35)
  Top 0.152: 583.51,16.77 MICROCONTROLLER1.33 585.01,16.77 v585.28,16.49 | L5.1 583.04,21.7 v583.69,22.34
  Route2 0.152: v585.28,16.49 585.28,18.19 585.43,18.34 585.43,20.6 v583.69,22.34
  Bottom 0.152: v583.69,22.34 583.82,22.39 | v585.28,16.49 585.64,16.49
GLED
  Top 0.152: R27.2 575.58,11.78 MICROCONTROLLER1.12
GND  (via drill 0.35)
  Top 0.152: MICROCONTROLLER1.49 580.67,16.27 | TSX1.4 TSX1.2 575.71,23 574.54,21.83 573.65,21.83 573.29,21.48 573.29,20.38 574.53,19.14 BALUN1.6 BALUN1.5 | MICROCONTROLLER1.32 584.35,16.27 v585.29,15.41 | IMU1.18 568.39,2.95 568.6,2.95 568.66,3.01 568.66,3.09 568.6,3.15 568.39,3.15 IMU1.19 | IMU1.14 566.52,2.98 566.52,3.18 566.58,3.24 566.67,3.24 566.73,3.18 566.73,2.98 IMU1.15 566.95,2.98 566.95,3.18 567.01,3.24 567.1,3.24 567.16,3.18 567.16,2.98 IMU1.16 567.38,2.98 567.38,3.18 567.44,3.24 567.53,3.24 567.59,3.18 567.59,2.98 IMU1.17 567.81,2.98 567.81,3.18 567.87,3.24 568.26,3.24 IMU1.19 | IMU1.19 568.17,3.38 568.01,3.38 567.95,3.44 567.95,3.52 568.01,3.58 568.17,3.58 IMU1.20 568.35,3.76 570.41,3.75 574.28,7.36 v578.85,7.35 | C21.2 588.82,17.65 v589.51,17.19 | v575.71,24.66 576.91,24.66 577.43,24.14 578.45,24.14 C32.2 | C35.2 567.44,14.96 567.06,14.58 567.07,14.59 v566.65,14.16 | 573.6,9.22 573.6,8.35 v573.19,7.82 | C31.2 v580.57,25.99 | U$13.GND1 567.52,25.32 U$13.GND2 568.92,25.32 U$13.GND3 | R30.2 584.42,20.34 585.47,20.34 585.68,20.12 585.68,18.87 585.82,18.73 587.01,18.73 587.04,18.7 | C33.2 587.85,10.79 v588.28,11.22 v588.29,11.22 589.49,11.22 592.98,14.71 U$16.FOOT1 U$16.FOOT3 | U$16.FOOT2 593.56,20.41 593.14,19.99 U$16.1 591.81,19.36 590.06,21.11 590.06,22.1 C45.2 | U$16.FOOT4 U$16.FOOT2 | C46.2 594.48,20.48 U$16.FOOT2
  Top 0.254: 580.67,16.27 MICROCONTROLLER1.32 | 575.71,23 v575.71,24.66 | C34.2 L6.2 v566.96,19.39 | LED4.C 572.14,9.84 C40.2 572.76,9.22 573.6,9.22 C39.2 575.15,9.8 LED5.C | C30.2 580.58,24.89 580.52,24.95 C31.2 | U$13.GND1 567.23,24.38 566.75,24.38 | C43.1 566.75,24.38 | 568.92,25.32 | U$15.6 586.79,18.95 587.04,18.7 C21.2 | C45.2 591.23,22.12 591.7,22.52 v591.7,23.22 | 566.75,24.38 v566.75,26.32
  Top 1.016: REAR_PANEL1.- v574.73,30.88
  Route2 0.152: v589.51,17.19 589.64,17.14 | v566.65,14.16 566.41,13.94 | v566.96,19.39 566.73,19.42 | 582.56,7.5 582.19,7.49 | v588.28,11.22 588.28,10.92 | v573.19,7.82 573.23,7.65 | v578.85,7.35 578.92,7.37 | v580.57,25.99 580.7,26.12 | v566.75,26.32 566.44,26.64
  Route2 0.254: v591.7,23.22 591.77,23.38
  Route2 1.016: v575.71,24.66 575.64,29.7 v574.73,30.88
  Bottom 0.152: 575.96,24.66 v575.71,24.66 574.91,23.86 C41.2 | v585.29,15.41 585.54,15.39 | GPS1.22 GPS1.21 578.58,12.2 GPS1.69 | GPS1.69 GPS1.64 578.48,13.8 GPS1.19 | GPS1.25 GPS1.24 578.38,10.91 578.38,11.7 | GPS1.69 578.38,11.7 | GPS1.31 572.98,11.75 | 572.98,11.75 572.98,11.8 GPS1.65 | GPS1.33 571.38,11.4 GPS1.65 | GPS1.11 GPS1.10 578.38,19.89 GPS1.49 579.78,17 GPS1.15 580.46,16.61 580.51,16.61 581.45,15.67 581.45,15.37 582.13,14.7 R29.2 | GPS1.65 GPS1.60 GPS1.61 GPS1.62 | R41.2 573.23,7.86 v573.19,7.82 | C44.2 588.4,18.3 v589.51,17.19 | U$1.SGND U$1.PGND 582.43,24.13 582.08,24.48 582.07,24.48 v580.57,25.99 | 578.38,11.7 577.12,11.7 576.57,11.15 576.57,11.1 GPS1.27 GPS1.28 GPS1.29 574.18,11.1 574.18,11.15 573.59,11.75 572.98,11.75 | U$14.GND3 578.08,4.67 U$14.GND2 576.68,4.67 U$14.GND1
  Bottom 0.254: v578.85,7.35 578.86,6.72 578.08,5.94 U$14.GND3 | C24.2 586.98,11.15 C25.2 | C25.2 586.99,10.07 C27.2 C28.2 | C29.2 582.65,12.02 | 582.65,12.02 C36.2 C37.2 C38.2 | v588.28,11.22 586.99,11.22 C25.2 | R29.2 582.13,12.54 582.65,12.02
  Bottom 1.016: FRONT_PANEL1.- v574.73,30.88
  pour Route2: 566.14,26.59 565.88,10.88 572.17,6.63 585.87,6.68 590.38,11.11 590.37,20.77 593,23.36 592.94,25.69 591.88,26.71 566.16,26.77 566.11,26.72
  pour Bottom: 564.45,26.64 564.45,9.11 564.41,7.12 569.86,7.09 569.83,0.83 588.36,0.72 588.39,6.47 599.07,6.51 599.05,26.69 564.44,26.69 564.44,26.64
GYRO_INT
  Top 0.152: MICROCONTROLLER1.19 580.17,3.33 578.94,2.1 565.45,2.1 565.07,2.48 565.07,3.19 565.51,3.63 565.76,3.63 IMU1.11
JTAG_TCKC
  Top 0.152: MICROCONTROLLER1.25 588.28,12.78 592.06,16.56 U$16.15 593.65,16.56 593.85,16.76 U$16.14
JTAG_TMSC
  Top 0.152: MICROCONTROLLER1.24 588.33,12.17 592.32,16.16 U$16.17 593.64,16.16 593.82,16.34 | 593.82,16.34 | 593.82,16.34 593.84,16.36 U$16.16
MAG_INT
  Top 0.152: MICROCONTROLLER1.20 580.67,3.4 579.07,1.8 565.32,1.8 564.77,2.35 564.77,3.74 565.51,4.49 565.76,4.49 IMU1.9
N$49
  Top 0.152: MICROCONTROLLER1.23 582.17,11.31 C33.1
N$50
  Top 0.152: MICROCONTROLLER1.4 569.12,16.77 C34.1 566.09,17.83 32.1.P2
N$51
  Top 0.152: C35.1 MICROCONTROLLER1.5 | C35.1 | 32.1.P1 567.03,16.27 C35.1
N$52
  Top 0.152: R26.1 573.76,13.12 LED4.A
N$53
  Top 0.152: R27.1 573.79,10.64 LED5.A
N$54
  Top 0.152: IMU1.21 570.25,4.12 C39.1
N$55
  Top 0.152: IMU1.24 570.18,5.41 571.47,6.7 571.45,9.23 C40.1
N$56
  Top 0.152: 565.83,6.2 IMU1.6 565.72,5.73 565.51,5.73 565.45,5.67 565.45,5.59 | 565.83,6.2 R28.2 | IMU1.5 566.3,5.93 566.3,6.08 566.18,6.2 565.83,6.2 | 565.45,5.59 565.51,5.53 565.72,5.53 IMU1.7 | IMU1.8 565.72,5.1 565.51,5.1 565.45,5.16 565.45,5.59
N$57
  Bottom 0.152: 570.68,17.81 GPS1.42 569.07,17.8 R31.1
N$58
  Bottom 0.152: LED6.C R32.2
N$59
  Bottom 0.152: GPS1.9 577.81,22.4 R33.1
N$60
  Bottom 0.152: C41.1 R34.2 571.2,20.27 GPS1.1
N$61
  Bottom 0.152: R35.1 582.93,20.16 U$1.ENA
N$62
  Bottom 0.152: U$1.OUT1 584.06,24.12 R36.1
N$63
  Top 0.152: MICROCONTROLLER1.1 576.45,18.39 BALUN1.4
N$64
  Top 0.152: MICROCONTROLLER1.2 576.45,17.65 576.21,17.65 576.15,17.59 BALUN1.3
N$65
  Top 0.152: MICROCONTROLLER1.3 575.88,17.27 575.75,17.13 575.31,17.13 575.03,17.41 BALUN1.2
N$66
  Top 0.152: BALUN1.1
  Top 0.254: BALUN1.1 C42.2
N$67
  Top 0.152: R43.2 570.56,21.42 570.23,21.09
  Top 0.254: L6.1 568.61,21.09 | 568.61,21.09 568.99,21.09 | R39.1 568.53,21.01 568.61,21.09
  Top 0.508: R39.1 568.22,21.01 | R37.2 570.56,21.42 | L6.1 570.23,21.09
N$68
  Top 0.254: R37.1 572.56,19.78
  Top 0.508: 572.56,19.78 C42.1
N$69
  Bottom 0.254: GPS1.32 572.18,10.21 R38.2
N$70
  Bottom 0.152: 574.41,9.23 R41.1 | 577.6,9.56 R44.1
  Bottom 0.508: R38.1 574.41,9.23 | R41.1 577.6,9.56 | R44.1 579.68,9.55 R40.2
N$71
  Bottom 0.152: R40.1 580.33,7.33
  Bottom 0.508: 580.33,7.33 L7.2
  Bottom 1.016: U$10.SIG 585.12,2.75 L7.2
N$72
  Top 0.254: R42.1 585.36,23.66 586.14,22.89 U$15.5
N$73
  Top 0.254: L8.1 587.44,22.16 U$15.7
N$74
  Bottom 0.152: U$14.SIG 577.38,7.66 R44.2
N$75
  Top 0.152: U$13.SIG 568.22,23.41 568.43,23.2 R43.1
N$76  (via drill 0.35)
  other vias: 598.2,7.46
N$77  (via drill 0.35)
  other vias: 595.83,7.47
N$78  (via drill 0.35)
  other vias: 593.2,7.46
N$79  (via drill 0.35)
  other vias: 590.7,7.42
N$80  (via drill 0.35)
  other vias: 587.78,4.51
N$81  (via drill 0.35)
  other vias: 587.85,1.39
N$82  (via drill 0.35)
  other vias: 585.26,1.37
N$83  (via drill 0.35)
  other vias: 583.18,2.77
N$84  (via drill 0.35)
  other vias: 562.79,19.62
N$85  (via drill 0.35)
  other vias: 562.84,17.33
N$86  (via drill 0.35)
  other vias: 562.84,14.71
N$87  (via drill 0.35)
  other vias: 562.85,12.21
N$88  (via drill 0.35)
  other vias: 562.92,9.35
N$89  (via drill 0.35)
  other vias: 562.74,23.23
N$90  (via drill 0.35)
  other vias: 562.94,6.45
N$91  (via drill 0.35)
  other vias: 563,3.27
N$92  (via drill 0.35)
  other vias: 598.19,10.09
N$93  (via drill 0.35)
  other vias: 598.16,12.87
N$94  (via drill 0.35)
  other vias: 598.33,25.82
N$95  (via drill 0.35)
  other vias: 598.42,22.93
N$96  (via drill 0.35)
  other vias: 582.12,1.41
NAV  (via drill 0.35)
  Top 0.152: v566.65,13.07 567.88,14.38 568.51,14.38 569.9,15.77 MICROCONTROLLER1.6
  Bottom 0.152: GPS1.7 576.21,22.71 R32.1 574.33,22.03 571.77,22.03 571.77,22.18 571.77,24.4 571.64,24.54 570.75,24.54 567.63,21.41 567.63,14.24 v566.65,13.07
PWM1  (via drill 0.35)
  Top 0.152: MICROCONTROLLER1.40 581.17,19.96 v581.5,20.33
  Bottom 0.152: U$1.IN1 582.43,21.22 v581.5,20.33
PWM2  (via drill 0.35)
  Top 0.152: MICROCONTROLLER1.41 580.67,19.95 v580.25,20.34
  Bottom 0.152: v580.25,20.34 581.93,22.02 U$1.IN2
RESET
  Top 0.152: MICROCONTROLLER1.35 586.67,17.77 C21.1 586.97,17.65 587.65,16.97 587.7,16.97 R23.1 589.59,16.56 591.18,18.16 U$16.7 593.64,18.16 593.8,18.33 | 593.8,18.33 | 593.8,18.33 593.84,18.36 U$16.6
RLED
  Top 0.152: R26.2 575.06,13.27 MICROCONTROLLER1.11
RXD  (via drill 0.35)
  Top 0.152: MICROCONTROLLER1.7 569.96,15.27 568.44,13.75 v568.24,13.71 | U$16.2 593.85,19.16 593.65,18.96 U$16.3 591.06,18.96 v590.55,19.47
  Route2 0.152: v590.55,19.47 586.2,15.12 586.2,15.04 584.28,13.11 569.15,13.11 568.56,13.71 v568.24,13.71
  Bottom 0.152: GPS1.44 570.03,19.39 568.87,19.39 568.21,18.08 v568.24,13.71
SCL
  Top 0.152: MICROCONTROLLER1.9 570.39,14.27 570.21,14.09 R24.1 569.48,11.99 569.48,10.79 567.7,9.01 IMU1.2
SDA  (via drill 0.35)
  Top 0.152: MICROCONTROLLER1.10 571.66,13.77 571.51,13.61 571.51,12.73 R25.1 570.2,10.65 v570,10.37 | v567.17,10.39 566.84,10.04 IMU1.4
  Bottom 0.152: 570.04,10.34 v570,10.37 569.33,10.37 v567.17,10.39
SOLAR_CELLS  (via drill 0.35)
  Top 0.152: REAR_PANEL1.+ 583.06,28.17 | 583.07,26.06 v583.05,26.07
  Top 0.254: 590.06,27.24 589.11,28.19 584.63,28.19 | 584.63,28.19 583.08,28.19 583.06,28.17 | 584.69,28.13 584.63,28.19 | R42.2 583.07,24.96 583.07,26.06 | L8.2 583.05,25.13 v583.05,26.07
  Top 0.406: C45.1 590.06,27.24
  Top 1.016: 583.06,28.17 v583.05,26.07
  Bottom 0.152: v583.05,26.07 582.89,26.01 | FRONT_PANEL1.+ 583.05,28.18
  Bottom 1.016: 583.05,28.18 v583.05,26.07
SWO
  Top 0.152: MICROCONTROLLER1.28 587.85,14.27 591.34,17.76 U$16.9 593.63,17.76 593.83,17.96 U$16.8
TDI
  Top 0.152: MICROCONTROLLER1.27 587.95,13.76 591.55,17.36 U$16.11 593.63,17.36 593.83,17.56 U$16.10
TDO
  Top 0.152: MICROCONTROLLER1.26 588.09,13.27 591.78,16.96 U$16.13 593.63,16.96 593.83,17.16 U$16.12
TXD  (via drill 0.35)
  Top 0.152: MICROCONTROLLER1.8 570.46,14.77 v569.41,13.72 | U$16.4 593.84,18.76 593.64,18.56 U$16.5 589.4,18.56 v589.09,18.88
  Route2 0.152: v589.09,18.88 585.89,15.69 585.89,15.16 584.45,13.72 v569.41,13.72
  Bottom 0.152: 568.98,16.51 R31.2 569.09,14.04 v569.41,13.72
VDDR  (via drill 0.35)
  Top 0.152: MICROCONTROLLER1.45 578.66,21.58 579.11,22.01 580.39,22.02 L5.2 | MICROCONTROLLER1.48 575.24,18.87 573.9,20.2 v573.9,21.23 | v577.6,24.85 578.7,24.85 578.74,24.82 578.8,24.75 arc90 C32.1 C31.1 580.52,23.65 580.58,23.59 C30.1 580.66,23.54 L5.2 | 580.57,21.8 L5.2
  Route2 0.152: v577.6,24.85 v573.9,21.23
VDDS  (via drill 0.35)
  Top 0.152: MICROCONTROLLER1.44 579.17,20.87 v579.49,21.18 | MICROCONTROLLER1.13 577.17,8.71 v576.52,8.02 | IMU1.3 567.29,9.39 568.36,10.45 568.34,11.18 567.27,11.18 567.27,11.26 R28.1 567.13,11.94 v567.57,12.39 | MICROCONTROLLER1.34 586.05,17.27 586.35,16.97 586.4,16.97 R23.2 586.82,15.83 v587.54,15.11 | v572.16,7.82 571.77,7.44 571.77,6.57 | IMU1.23 570.18,4.98 571.59,6.39 571.6,6.39 571.68,6.48 571.77,6.57 | IMU1.22 570.27,4.55 571.77,6.05 571.77,6.57 | IMU1.1 568.28,8.63 v569.3,9.67 | MICROCONTROLLER1.22 581.66,9.14 v581.35,8.94 | LS4.C v584.67,22.34 | U$16.18 593.85,15.96 593.64,15.76 U$16.19 592.87,15.76 v589.54,12.43 | C46.1 591.92,24.35 v591.67,24.59
  Top 0.254: R24.2 R25.2 568.89,11.41 R28.1 | U$15.1 U$15.8 arc-90 588.33,20.1 v589.51,20.1
  Route15 0.152: v579.49,21.18 579.77,21.14 | v587.54,15.11 587.88,15.11 | v569.3,9.67 569.24,9.59 | v567.57,12.39 567.87,12.39 | v581.35,8.94 581.35,8.64 | v572.16,7.82 572.27,7.76 | v576.52,8.02 576.52,7.79 | v589.51,20.1 589.61,20.22 | v572.18,21.35 572.3,21.47 | v574.01,22.73 574.01,22.87 | v584.67,22.34 584.72,22.32 | v589.54,12.43 589.54,12.28
  Route15 0.254: v591.67,24.59 591.64,24.88
  Bottom 0.152: GPS1.58 577.68,14.6 GPS1.18 580.46,14.21 580.51,14.21 581.35,13.37 v581.35,8.94 | R33.2 579.49,22.78 v579.49,21.18 | R33.2 580.33,23.62 U$1.VM | U$1.VCC 583.06,23.48 583.41,23.48 583.95,22.94 585.1,22.94 585.45,22.59 585.45,22.08 584.24,20.87 R35.2 584.29,20.1 C44.1 588.46,20.1 v589.51,20.1 | LED6.A 575.77,25.73 576.4,26.36 577.39,26.36 580.01,23.74 R33.2 | GPS1.2 v572.18,21.35 | R34.1 v574.01,22.73
  Bottom 0.254: v587.54,15.11 586.73,14.3 LS3.C 583.48,12.71 C29.1 | C25.1 585.68,11.16 C24.1 C29.1 | C25.1 585.69,10.08 C27.1 | C27.1 C28.1 | C28.1 | C37.1 583.92,10.07 C38.1 C28.1 | C37.1 583.93,11.14 C36.1 | C29.1 C36.1 | C37.1 585.69,10.08 C27.1 | C36.1 C25.1 | U$11.VCC 589.51,21.63 v589.51,20.1
  pour Route15: 566.14,26.58 565.89,10.88 572.38,6.59 585.85,6.7 590.34,11.11 590.35,20.79 592.99,23.41 592.95,25.63 591.85,26.73 591.8,26.68 566.13,26.75
X24M_N
  Top 0.152: TSX1.3 578.17,22.08 MICROCONTROLLER1.46
X24M_P
  Top 0.152: MICROCONTROLLER1.47 577.67,19.46 577.46,19.66 576.78,19.66 TSX1.1
(copper drawn outside any net)
  shapes: Top area x2

### Text on the board
tNames: Cornell University / / Space Systems / Design Studio
bNames: V. Hunter Adams / VHA3@CORNELL.EDU